# EAGLE design Hall_Sensor (EAGLE 9.3.0)
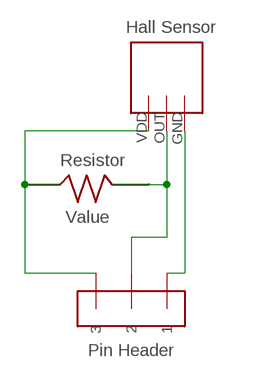
[diagram p0: schematic, sheet 1]

## Parts
U$1  HALL_SENSOR  [HALL_SENSOR]  (not placed on a sheet)
U$2  HALL_SENSOR  [HALL_SENSOR]  (not placed on a sheet)
U$3  RESISTOR  [RESISTOR]  (not placed on a sheet)
U$4  RESISTOR  [RESISTOR]  (not placed on a sheet)
U$5  RESISTOR  [RESISTOR]  (not placed on a sheet)
U$6  RESISTOR  [RESISTOR]  (not placed on a sheet)
U$7  HALL_SENSOR  [HALL_SENSOR]  (not placed on a sheet)
U$9  HALL_SENSOR  [HALL_SENSOR]
U$10  PIN_HEADER  [PIN_HEADER]
U$11  RESISTOR  [RESISTOR]

## Nets
N$1: U$9.OUT U$10.2 U$11.2
N$2: U$9.VDD U$10.3 U$11.1
N$3: U$9.GND U$10.1
Unconnected: U$1.GND U$1.OUT U$1.VDD U$2.GND U$2.OUT U$2.VDD U$7.GND U$7.OUT U$7.VDD

## Library data of the parts
U$1 U$2 U$7 U$9 = HallSensor_Circuit:HALL_SENSOR
U$3-U$6 U$11 = HallSensor_Circuit:RESISTOR
U$10 = HallSensor_Circuit:PIN_HEADER

## Board
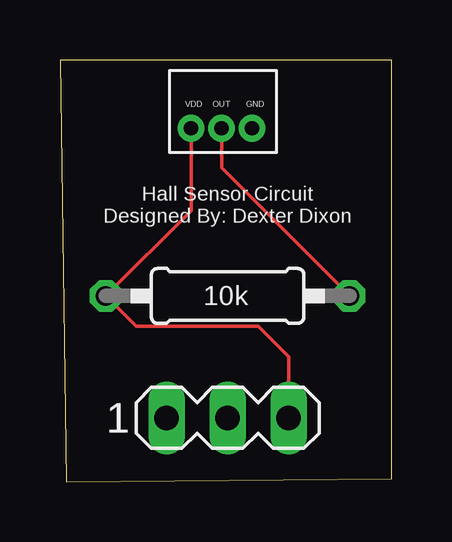
[diagram p1: board, top side]
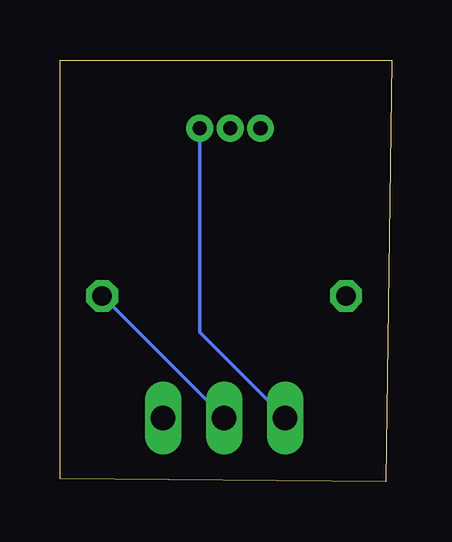
[diagram p2: board, bottom side, seen from below]

Size 13.82 x 17.58 mm. Coordinates in mm from the lower left corner, seen from the top.
Outline: 0.25,0 13.82,0.13 13.82,17.58 0,17.58 0.25,0
Copper layers (1*16): Top 0.035mm / dielectric 1.5mm / Bottom 0.035mm
Design rules "default": minimum track width 6mil, minimum drill 0.35mm, track to track 6mil, track to pad 6mil, pad to pad 6mil, via to via 6mil, smd to smd 6mil, copper to edge 40mil, drill to drill 6mil, minimum pad ring 10mil, minimum via ring 8mil, stop-mask expansion 4mil, vias tented up to drill 0mil, thermal gap 10mil

### Footprints (pad centres in the part's own frame; a part is rotated, then mirrored left to right if it is on the bottom)
HALL_SENSOR = drill 0.6: GND 1.27,-0.635; OUT 0,-0.635; VDD -1.27,-0.635
PIN_HEADER = drill 1.016 long: 1 -2.54,0; 2 0,0; 3 2.54,0
RESISTOR = drill 0.813 octagon: 1 -5.08,0; 2 5.08,0

### Placement (x,y rotation side)
U$9  6.73,15.37 0 top
U$10  6.98,2.67 0 top
U$11  6.98,7.75 0 top

### Tracks (layer width: path | path; a pad name or v marks a point on that pad's centre or on a via)
N$1
  Top 0.152: U$9.OUT 6.73,13.08 U$11.2
  Bottom 0.152: U$11.2 U$10.2
N$2
  Top 0.152: U$9.VDD 5.46,11.3 U$11.1 3.17,6.48 8.26,6.48 9.53,5.21 U$10.3
N$3
  Bottom 0.152: U$9.GND 8,6.22 U$10.1

### Text on the board
tPlace: Hall Sensor Circuit / Designed By: Dexter Dixon
tNames: VDD | OUT | GND | 10k